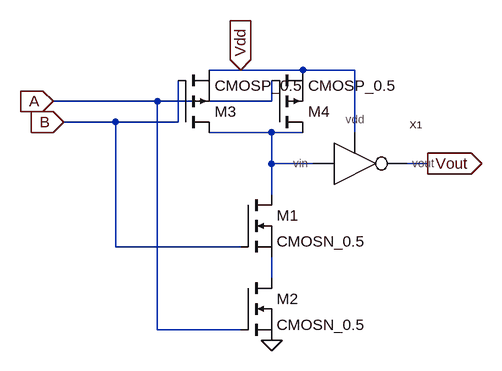
[diagram p0: schematic s_and.asc]
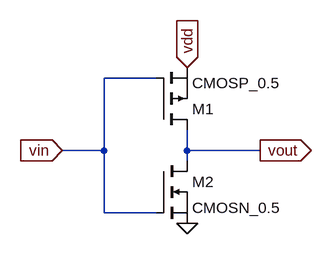
[diagram p1: sub-circuit s_inv.asc]
s_and.asc, the LTspice schematic file:
Version 4
SHEET 1 880 680
WIRE 128 -224 80 -224
WIRE 224 -224 128 -224
WIRE 304 -224 224 -224
WIRE 0 -176 -160 -176
WIRE 176 -176 176 -208
WIRE 176 -176 0 -176
WIRE -64 -144 -144 -144
WIRE 32 -144 32 -208
WIRE 32 -144 -64 -144
WIRE 176 -128 80 -128
WIRE 224 -128 176 -128
WIRE 304 -128 304 -224
WIRE 176 -80 176 -128
WIRE 240 -80 176 -80
WIRE 416 -80 384 -80
WIRE 176 -32 176 -80
WIRE -64 48 -64 -144
WIRE 128 48 -64 48
WIRE 176 96 176 64
WIRE 0 176 0 -176
WIRE 128 176 0 176
FLAG 128 -224 Vdd
IOPIN 128 -224 In
FLAG -160 -176 A
IOPIN -160 -176 In
FLAG -144 -144 B
IOPIN -144 -144 In
FLAG 416 -80 Vout
IOPIN 416 -80 Out
FLAG 176 192 0
SYMBOL nmos 128 -32 R0
SYMATTR InstName M1
SYMATTR Value CMOSN_0.5
SYMBOL nmos 128 96 R0
SYMATTR InstName M2
SYMATTR Value CMOSN_0.5
SYMBOL pmos 32 -128 M180
SYMATTR InstName M3
SYMATTR Value CMOSP_0.5
SYMBOL pmos 176 -128 M180
SYMATTR InstName M4
SYMATTR Value CMOSP_0.5
SYMBOL s_inv 304 -80 R0
SYMATTR InstName X1

s_inv.asc, the sub-circuit schematic file:
Version 4
SHEET 1 880 680
WIRE 128 -112 48 -112
WIRE 48 0 48 -112
WIRE 48 0 -16 0
WIRE 176 0 176 -32
WIRE 288 0 176 0
WIRE 176 16 176 0
WIRE 48 96 48 0
WIRE 128 96 48 96
FLAG 288 0 vout
IOPIN 288 0 Out
FLAG -16 0 vin
IOPIN -16 0 In
FLAG 176 -128 vdd
IOPIN 176 -128 In
FLAG 176 112 0
SYMBOL pmos 128 -32 M180
SYMATTR InstName M1
SYMATTR Value CMOSP_0.5
SYMBOL nmos 128 16 R0
SYMATTR InstName M2
SYMATTR Value CMOSN_0.5

The netlist it stands for:
* s_and.asc
M1 N001 B N002 N002 CMOSN_0.5
M2 N002 A 0 0 CMOSN_0.5
M3 N001 B Vdd Vdd CMOSP_0.5
M4 N001 A Vdd Vdd CMOSP_0.5
XX1 N001 Vout Vdd s_inv

* block symbol definitions
.subckt s_inv vin vout vdd
M1 vout vin vdd vdd CMOSP_0.5
M2 vout vin 0 0 CMOSN_0.5
.ends s_inv

.model NMOS NMOS
.model PMOS PMOS
.lib standard.mos
.backanno
.end